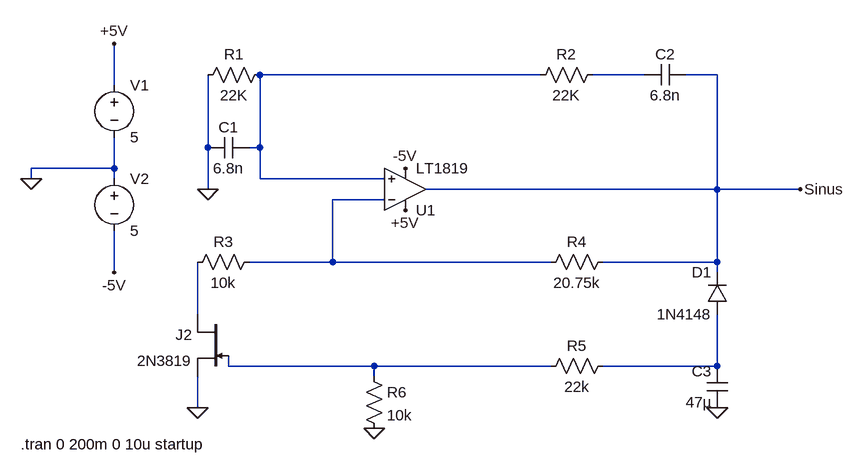
[diagram p0: schematic Oszi.asc]
Oszi.asc, the LTspice schematic file:
Version 4.1
SHEET 1 932 792
WIRE 448 208 16 208
WIRE 608 208 528 208
WIRE 720 208 672 208
WIRE -208 224 -208 160
WIRE -64 320 -64 208
WIRE 16 320 16 208
WIRE 16 320 0 320
WIRE -208 352 -208 304
WIRE -208 352 -336 352
WIRE -336 368 -336 352
WIRE -208 368 -208 352
WIRE 16 368 16 320
WIRE 208 368 16 368
WIRE -64 384 -64 320
WIRE 720 384 720 208
WIRE 720 384 272 384
WIRE 848 384 720 384
WIRE 208 400 128 400
WIRE 128 496 128 400
WIRE 128 496 0 496
WIRE 464 496 128 496
WIRE 720 496 720 384
WIRE 720 496 544 496
WIRE -208 512 -208 448
WIRE 720 512 720 496
WIRE -80 576 -80 496
WIRE -32 656 -32 640
WIRE 192 656 -32 656
WIRE 464 656 192 656
WIRE 720 656 720 576
WIRE 720 656 544 656
WIRE 192 672 192 656
WIRE -80 720 -80 672
FLAG -64 384 0
FLAG -336 368 0
FLAG -208 160 +5V
FLAG -208 512 -5V
FLAG 240 352 -5V
FLAG 240 416 +5V
FLAG -80 720 0
FLAG 720 720 0
FLAG 192 752 0
FLAG 848 384 Sinus
SYMBOL res 32 192 R90
WINDOW 0 0 56 VBottom 2
WINDOW 3 32 56 VTop 2
SYMATTR InstName R1
SYMATTR Value 22K
SYMBOL res 544 192 R90
WINDOW 0 0 56 VBottom 2
WINDOW 3 32 56 VTop 2
SYMATTR InstName R2
SYMATTR Value 22K
SYMBOL res 16 480 R90
WINDOW 0 0 56 VBottom 2
WINDOW 3 32 56 VTop 2
SYMATTR InstName R3
SYMATTR Value 10k
SYMBOL res 560 480 R90
WINDOW 0 0 56 VBottom 2
WINDOW 3 32 56 VTop 2
SYMATTR InstName R4
SYMATTR Value 20.75k
SYMBOL res 560 640 R90
WINDOW 0 0 56 VBottom 2
WINDOW 3 32 56 VTop 2
SYMATTR InstName R5
SYMATTR Value 22k
SYMBOL cap 0 304 R90
WINDOW 0 0 32 VBottom 2
WINDOW 3 32 32 VTop 2
SYMATTR InstName C1
SYMATTR Value 6.8n
SYMBOL cap 672 192 R90
WINDOW 0 0 32 VBottom 2
WINDOW 3 32 32 VTop 2
SYMATTR InstName C2
SYMATTR Value 6.8n
SYMBOL cap 736 720 R180
WINDOW 0 24 56 Left 2
WINDOW 3 24 8 Left 2
SYMATTR InstName C3
SYMATTR Value 47µ
SYMBOL lib\\sym\\OpAmps\\LT1819 240 384 M180
SYMATTR InstName U1
SYMBOL diode 736 576 R180
WINDOW 0 24 64 Left 2
WINDOW 3 24 0 Left 2
SYMATTR InstName D1
SYMATTR Value 1N4148
SYMBOL voltage -208 208 R0
SYMATTR InstName V1
SYMATTR Value 5
SYMBOL voltage -208 352 R0
SYMATTR InstName V2
SYMATTR Value 5
SYMBOL lib\\sym\\njf -32 576 M0
SYMATTR InstName J2
SYMATTR Value 2N3819
SYMBOL res 176 656 R0
SYMATTR InstName R6
SYMATTR Value 10k
TEXT -352 776 Left 2 !.tran 0 200m 0 10u startup

The netlist it stands for:
* Oszi.asc
R1 N001 0 22K
R2 N002 N001 22K
R3 N003 N004 10k
R4 Sinus N003 20.75k
R5 N006 N005 22k
C1 N001 0 6.8n
C2 Sinus N002 6.8n
C3 0 N006 47µ
* U1: LT1819 (symbol lib\sym\OpAmps\LT1819 not available, pins judged from their places): In+=N001 In-=N003 V+=+5V V-=-5V OUT=Sinus
D1 N006 Sinus 1N4148
V1 +5V 0 5
V2 0 -5V 5
J2 N004 N005 0 2N3819
R6 N005 0 10k
.model D D
.lib standard.dio
.model NJF NJF
.model PJF PJF
.lib standard.jft
.tran 0 200m 0 10u startup
.backanno
.end